# EAGLE design metiumacs4 (EAGLE 7.3.0)
metium
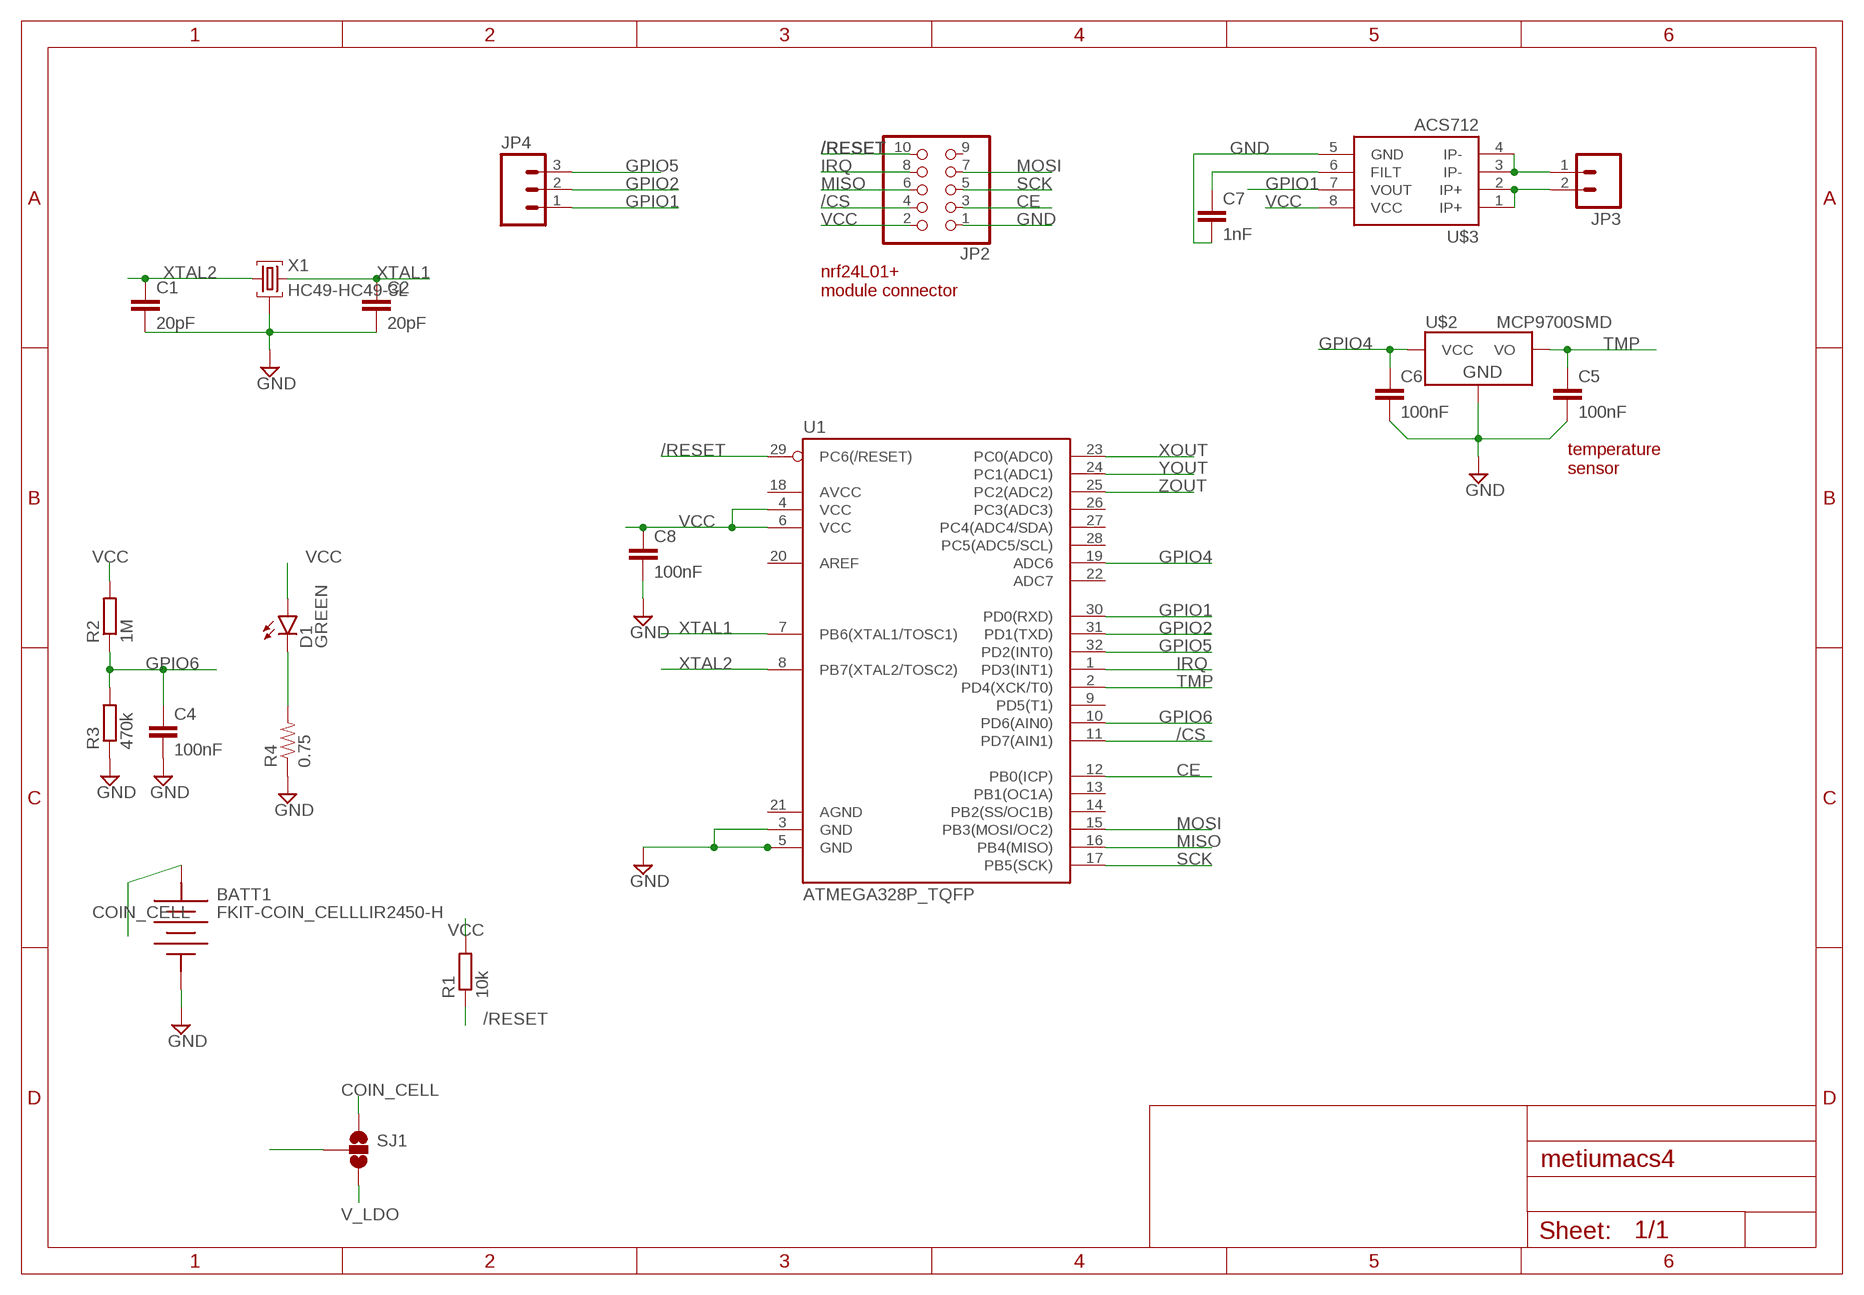
[diagram p0: schematic, sheet 1]

## Parts
BATT1  FKIT-COIN_CELLLIR2450-H  [FKIT-LIR2450-H]
C1  20pF  CAP0805  [0805]
C2  20pF  CAP0805  [0805]
C4  100nF  C-EUC0805  [C0805]
C5  100nF  C-EUC0805  [C0805]
C6  100nF  C-EUC0805  [C0805]
C7  1nF  1NF/1000PF-50V-10%(0603)  [0603-CAP]
C8  100nF  CAP0805  [0805]
D1  GREEN  LED-GREEN0603  [LED-0603]
JP2  PINHD-2X5  [2X05M]
JP3  M02PTH4  [1X02_XTRA_BIG]
JP4  M03LONGPADS  [1X03_LONGPADS]
R1  10k  R-EU_R0805  [R0805]
R2  1M  R-EU_R0805  [R0805]
R3  470k  R-EU_R0805  [R0805]
R4  0.75  0.75OHM-1/4W-1%(0805)  [0805]
SJ1  SOLDERJUMPER_2WAYS  [SJ_3]
U1  ATMEGA328P_TQFP  [TQFP32-08]
U$2  MCP9700SMD  [SOT23-3]
U$3  ACS712  [SO08]
X1  HC49-HC49-3L  [HC49-3L]

## Nets
/CS: JP2.4 U1.11(PD7(AIN1))
/RESET: JP2.10 R1.1 U1.29(PC6(/RESET))
CE: JP2.3 U1.12(PB0(ICP))
COIN_CELL: BATT1.POS SJ1.1
FS1: JP3.1 U$3.3(IP-) U$3.4(IP-)
FS2: JP3.2 U$3.1(IP+) U$3.2(IP+)
GND: BATT1.NEG C1.2 C2.2 C4.2 C5.2 C6.2 C7.2 C8.2 JP2.1 R3.1 R4.1 U1.3(GND) U1.5(GND) U$2.3(GND) U$3.5(GND) X1.2
GPIO1: JP4.1 U1.30(PD0(RXD)) U$3.7(VOUT)
GPIO2: JP4.2 U1.31(PD1(TXD))
GPIO4: C6.1 U1.19(ADC6) U$2.1(VCC)
GPIO5: JP4.3 U1.32(PD2(INT0))
GPIO6: C4.1 R2.1 R3.2 U1.10(PD6(AIN0))
IRQ: JP2.8 U1.1(PD3(INT1))
MISO: JP2.6 U1.16(PB4(MISO))
MOSI: JP2.7 U1.15(PB3(MOSI/OC2))
N$2: C7.1 U$3.6(FILT)
N$8: D1.C R4.2
SCK: JP2.5 U1.17(PB5(SCK))
TMP: C5.1 U1.2(PD4(XCK/T0)) U$2.2(VO)
V_LDO: SJ1.3
VCC: C8.1 D1.A JP2.2 R1.2 R2.2 SJ1.2 U1.4(VCC) U1.6(VCC) U$3.8(VCC)
XOUT: U1.23(PC0(ADC0))
XTAL1: C2.1 U1.7(PB6(XTAL1/TOSC1)) X1.3
XTAL2: C1.1 U1.8(PB7(XTAL2/TOSC2)) X1.1
YOUT: U1.24(PC1(ADC1))
ZOUT: U1.25(PC2(ADC2))
Unconnected: JP2.9 U1.9(PD5(T1)) U1.13(PB1(OC1A)) U1.14(PB2(SS/OC1B)) U1.18(AVCC) U1.20(AREF) U1.21(AGND) U1.22(ADC7) U1.26(PC3(ADC3)) U1.27(PC4(ADC4/SDA)) U1.28(PC5(ADC5/SCL))

## Notes on the sheet
- nrf24L01+ 
  module connector
- temperature
  sensor

## Library data of the parts
BATT1 = SparkFun-Electromechanical:FKIT-COIN_CELL: Fabrick.it Coin Cell Holder Coin cell holder for 24.5mm rechargable coin cell
C1 C2 C8 = SparkFun-Passives:CAP: Capacitor Standard 0603 ceramic capacitor, and 0.1" leaded capacitor.
C4-C6 = rcl:C-EU: CAPACITOR, European symbol
C7 = SparkFun-Capacitors:1NF/1000PF-50V-10%(0603): CAP-07886; PROD_ID: CAP-07886
D1 = SparkFun-LED:LED-GREEN: Various green LEDs Green LEDs used in SFE Production 0603- DIO-00821 LARGE- DIO-00862 LILYPAD- DIO-09910; PROD_ID: DIO-00821
JP2 = madar:PINHD-2X5: PIN HEADER
JP3 = SparkFun-Connectors:M02: Standard 2-pin 0.1" header. Use with - straight break away headers ( PRT-00116) - right angle break away headers (PRT-00553) - swiss pins (PRT-00743) - machine pins (PRT-00117) - female headers (PRT-00115) Molex polarized connector foot print use with: PRT-08233 with associated crimp pins and housings. 2.54_SCREWTERM for use with PRT-10571. 3.5mm Screw Terminal footprints for PRT-08084 5mm Screw Terminal footprints for use with PRT-08432
JP4 = SparkFun-Connectors:M03: Header 3 Standard 3-pin 0.1" header. Use with straight break away headers (SKU : PRT-00116), right angle break away headers (PRT-00553), swiss pins (PRT-00743), machine pins (PRT-00117), and female headers (PRT-00115). Molex polarized connector foot print use with SKU : PRT-08232 with associated crimp pins and housings.
R1-R3 = rcl:R-EU_: RESISTOR, European symbol
R4 = SparkFun-Resistors:0.75OHM-1/4W-1%(0805): RES-08474; PROD_ID: RES-08474
SJ1 = SparkFun-Passives:SOLDERJUMPER_2WAY: Solder Jumper 2 way solder jumper
U1 = SparkFun-DigitalIC:ATMEGA328P_TQFP; PROD_ID: IC-09069
U$2 = SparkFun-Sensors:MCP9700: Analog-output temperature sensor
U$3 = SparkFun-AnalogIC:ACS712: Hall-effect-based isolated linear current sensor
X1 = IQD-Frequency-Products:HC49: Crystals; MFD: IQD Frequency Products

## Board
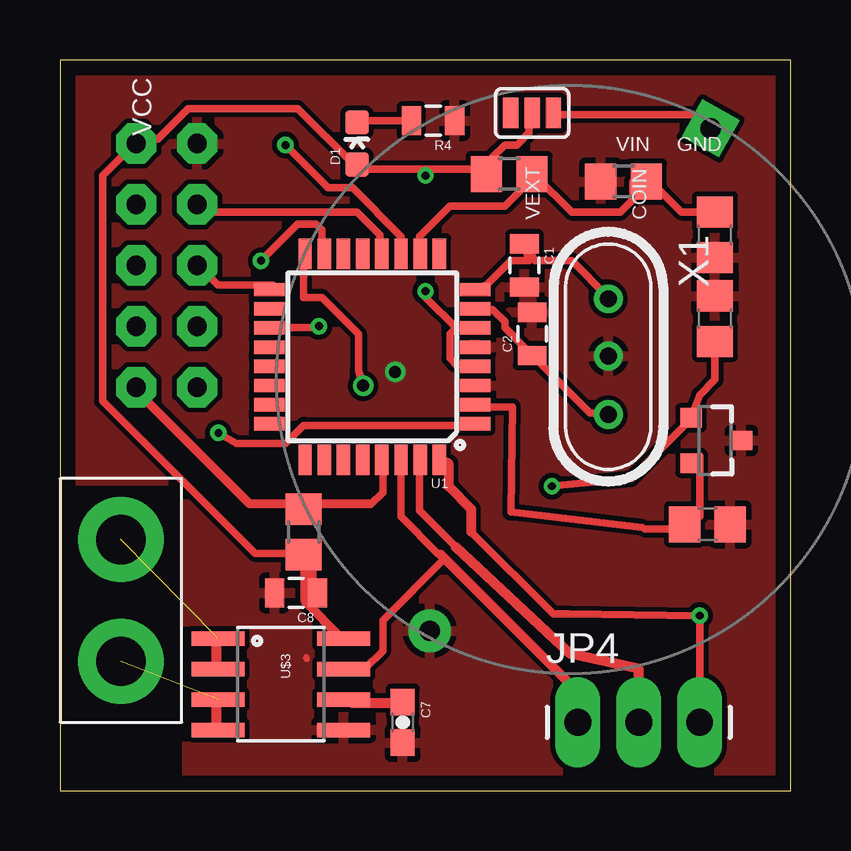
[diagram p1: board, top side]
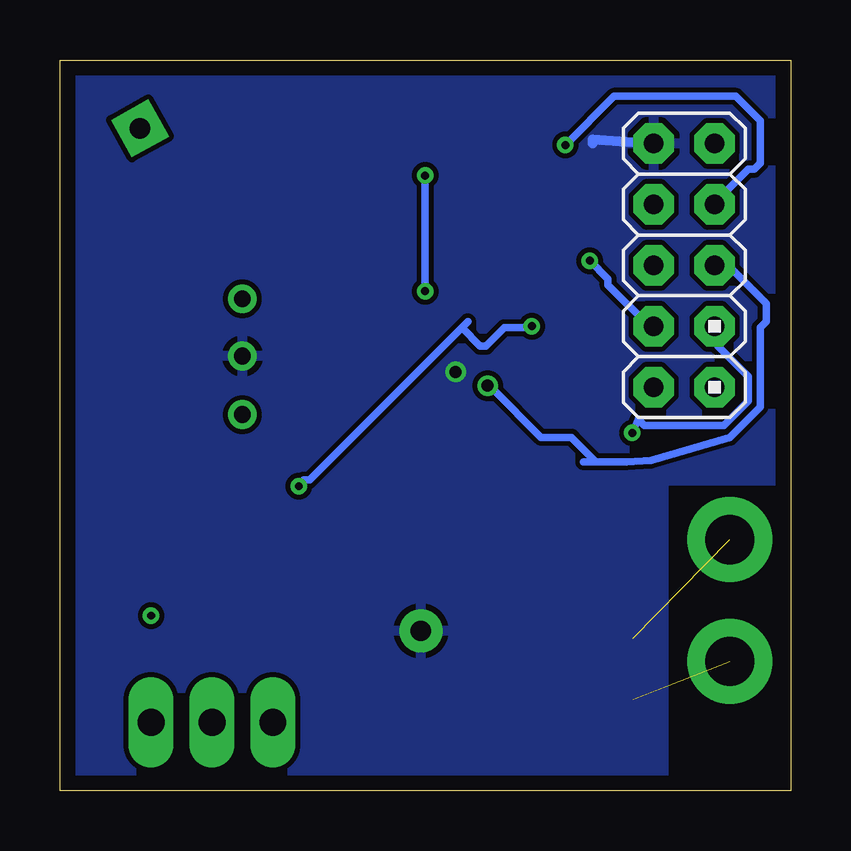
[diagram p2: board, bottom side, seen from below]

Size 30.47 x 30.47 mm. Coordinates in mm from the lower left corner, seen from the top.
Outline: 0,0 30.47,0 30.47,30.47 0,30.47 0,0
Copper layers (1*16): Top 0.0356mm / dielectric 1.5011mm / Bottom 0.0356mm
Design rules "LaenPCBOrder *": minimum track width 12mil, minimum drill 13mil, track to track 8mil, track to pad 10mil, pad to pad 8mil, via to via 15mil, smd to smd 6mil, copper to edge 25mil, drill to drill 15mil, minimum pad ring 7mil, minimum via ring 7mil, stop-mask expansion 4mil, vias tented up to drill 0mil, thermal gap 10mil
tRestrict: area 0.6,0.2 to 5.1,12.7
bRestrict: area 0.6,0.2 to 5.1,12.7

### Footprints (pad centres in the part's own frame; a part is rotated, then mirrored left to right if it is on the bottom)
FKIT-LIR2450-H = drill 0.85 pad 1.778: NEG -12,0 | drill 0.85 pad 1.778 square: POS 12,0
0805 = smd 0.8 x 1.2: 1 -0.9,0; 2 0.9,0
C0805 = smd 1.3 x 1.5: 1 -0.95,0; 2 0.95,0
0603-CAP = smd 1.1 x 1: 1 -0.85,0; 2 0.85,0
LED-0603 = smd 1 x 1: A 0,-0.877; C 0,0.877
2X05M = drill 0.8 pad 1.676 octagon: 1 -5.08,-1.27; 2 -5.08,1.27; 3 -2.54,-1.27; 4 -2.54,1.27; 5 0,-1.27; 6 0,1.27; 7 2.54,-1.27; 8 2.54,1.27; 9 5.08,-1.27; 10 5.08,1.27
1X02_XTRA_BIG = drill 2.057 pad 3.556: 1 -2.54,0; 2 2.54,0
1X03_LONGPADS = drill 1.118 pad 1.88 long: 1 0,0; 2 2.54,0; 3 5.08,0
R0805 = smd 1.3 x 1.5: 1 -0.95,0; 2 0.95,0
SJ_3 = smd 0.635 x 1.27: 1 -0.889,0; 2 0,0; 3 0.889,0
TQFP32-08 = smd 1.27 x 0.559: 1 -4.293,2.8; 2 -4.293,2; 3 -4.293,1.2; 4 -4.293,0.4; 5 -4.293,-0.4; 6 -4.293,-1.2; 7 -4.293,-2; 8 -4.293,-2.8; 17 4.293,-2.8; 18 4.293,-2; 19 4.293,-1.2; 20 4.293,-0.4; 21 4.293,0.4; 22 4.293,1.2; 23 4.293,2; 24 4.293,2.8 | smd 0.559 x 1.27: 9 -2.8,-4.293; 10 -2,-4.293; 11 -1.2,-4.293; 12 -0.4,-4.293; 13 0.4,-4.293; 14 1.2,-4.293; 15 2,-4.293; 16 2.8,-4.293; 25 2.8,4.293; 26 2,4.293; 27 1.2,4.293; 28 0.4,4.293; 29 -0.4,4.293; 30 -1.2,4.293; 31 -2,4.293; 32 -2.8,4.293
SOT23-3 = smd 0.8 x 0.9: 1 -0.95,-1; 2 0.95,-1; 3 0,1.1
SO08 = smd 0.61 x 2.21: 1 -1.905,-2.616; 2 -0.635,-2.616; 3 0.635,-2.616; 4 1.905,-2.616; 5 1.905,2.616; 6 0.635,2.616; 7 -0.635,2.616; 8 -1.905,2.616
HC49-3L = drill 0.7 pad 1.2: 1 -2.413,0; 2 -0.027,0; 3 2.413,0

### Placement (x,y rotation side)
BATT1  21.27,17.14 60.8 top
C1  19.37,21.91 270 top
C2  19.68,19.05 90 top
C4  27.3,23.18 270 top
C5  26.99,11.11 0 top
C6  27.3,19.68 90 top
C7  14.29,2.86 270 top
C8  9.84,8.26 180 top
D1  12.38,26.99 0 top
JP2  4.45,21.91 270 bottom
JP3  2.54,7.94 90 top
JP4  21.59,2.86 0 top
R1  10.16,10.79 270 top
R2  18.73,25.72 180 top
R3  23.5,25.4 0 top
R4  15.56,27.94 180 top
SJ1  19.68,28.26 180 top
U1  13.02,18.1 180 top
U$2  27.3,14.61 270 top
U$3  9.21,4.45 270 top
X1  22.86,18.1 270 top

### Tracks (layer width: path | path; a pad name or v marks a point on that pad's centre or on a via)
/CS  (via drill 0.33)
  Top 0.305: v9.4,26.92 11.18,25.15 12.19,25.15 14.22,23.11 14.22,22.61 U1.11
  Bottom 0.305: v9.4,26.92 7.37,28.96 2.29,28.96 1.27,27.94 1.27,26.16 1.52,25.91 1.78,25.91 3.05,24.64 JP2.4
/RESET
  Top 0.305: U1.29 13.46,13.72 13.46,12.45 12.95,11.94 12.85,11.98
  Top 0.381: 12.85,11.98 10.22,11.98 R1.1 9.93,11.98 7.89,11.98 3.21,16.65 JP2.10
CE
  Top 0.305: JP2.3 5.71,24.13 12.38,24.13 13.34,23.18 13.34,22.54 U1.12
COIN_CELL
  Top 0.305: SJ1.1 20.57,28.19 26.42,28.19 26.92,27.69 BATT1.POS
FS1  (1 unrouted)
  Top 0.406: U$3.4 6.5,2.44 6.5,3.66 U$3.3
FS2  (1 unrouted)
  Top 0.406: U$3.2 6.5,5.28 6.5,6.1 U$3.1
GND  (via drill 0.5)
  Top 0.254: 10.29,5.49 10.26,5.57
  Bottom 0.406: JP2.1 8.27,27.16 8.27,26.99
  other vias: 13.97,17.46
  pour Top: -0.32,-0.32 30.8,-0.32 30.8,30.8 -0.32,30.8
  pour Bottom: 0,0 30.48,0 30.48,30.48 0,30.48
GPIO1
  Top 0.305: 16.03,9.68 13.46,7.11 13.46,5.84 12.7,5.08 U$3.7 | U1.30 14.22,13.72 14.22,11.43 15.75,9.91 15.88,9.84
  Top 0.406: 15.88,9.84 16.03,9.68 21.59,4.13 JP4.1
GPIO2
  Top 0.305: 16.51,10.16 14.99,11.68 14.99,13.72 U1.31
  Top 0.406: 16.51,10.16 21.27,5.71 24.13,5.08 JP4.2
GPIO4  (via drill 0.33)
  Top 0.305: C6.1 27.3,17.14 26.67,16.51 U$2.1 26.04,15.24 23.81,13.02 v20.51,12.7 | v10.79,19.37 10.67,19.3 8.89,19.3 U1.19
  Bottom 0.305: 13.72,19.3 20.07,12.95 20.32,12.95 20.57,12.7 v20.51,12.7 | 13.72,19.3 13.46,19.56 | v10.79,19.37 10.92,19.3 11.94,19.3 12.7,18.54 12.95,18.54 13.72,19.3
GPIO5  (via drill 0.33)
  Top 0.305: 17.14,10.79 20.57,7.37 21.21,7.37 v26.67,7.3 JP4.3
  Top 0.406: 17.14,10.79 17.14,11.75 16.19,12.7 16.19,13.65 U1.32
GPIO6
  Top 0.305: 19.81,25.65 18.54,24.38 16.26,24.38 14.99,23.11 14.99,22.61 U1.10 | 19.81,25.65 21.34,24.13 23.37,24.13 23.88,24.64 23.88,25.4 R3.2 24.64,25.4 25.91,24.13 27.18,24.13 C4.1 | 19.81,25.65 R2.1
IRQ  (via drill 0.33)
  Top 0.305: v6.6,14.92 7.37,14.48 9.4,14.48 10.16,15.24 17.27,15.24 U1.1
  Bottom 0.305: JP2.8 3.05,19.3 3.05,18.54 1.78,17.27 1.78,16.26 2.79,15.24 6.1,15.24 6.35,15.49 v6.6,14.92
MISO  (via drill 0.5)
  Top 0.305: U1.16 10.16,22.35 10.16,20.57 10.92,20.57 12.45,19.05 12.45,17.53 v12.64,16.89
  Bottom 0.305: JP2.6 3.05,21.84 2.54,21.84 1.02,20.32 1.02,19.56 1.27,19.3 1.27,16 2.54,14.73 5.84,13.78 6.86,13.72 8.13,13.72 | 8.13,13.72 8.64,13.72 | 8.13,13.72 9.14,14.73 10.41,14.73 12.45,16.76 v12.64,16.89
MOSI  (via drill 0.33)
  Top 0.305: v8.38,22.1 9.91,23.62 10.67,23.62 10.92,23.37 10.92,22.61 U1.15
  Bottom 0.305: v8.38,22.1 7.62,21.34 7.62,21.08 5.84,19.3 JP2.7
N$2
  Top 0.406: C7.1 14.22,3.66 12.19,3.66 U$3.6
N$8
  Top 0.305: R4.2 12.45,27.94 D1.C
SCK
  Top 0.305: U1.17 8.89,21.08 6.6,21.08 5.84,21.84 JP2.5
TMP
  Top 0.305: U$2.2 26.67,13.97 26.67,11.43 C5.1 25.91,10.92 24.38,10.92 24.26,10.99 18.8,11.62 18.86,16 17.53,16 U1.2
VCC  (via drill 0.33)
  Top 0.254: 10.16,9.65 R1.2 | 10.67,8.38 C8.1 10.92,8.13 | 11.68,6.35 U$3.8
  Top 0.305: 15.24,25.91 17.78,25.91 R2.2 18.03,26.42 18.54,26.92 19.05,26.92 19.56,27.43 19.56,28.19 SJ1.2 | 15.24,25.91 12.45,25.91 D1.A 12.19,26.16 9.91,28.45 5.33,28.45 4.06,27.18 3.3,27.18 JP2.2 3.05,26.92 1.78,25.65 1.78,16.26 8.13,9.91 10.16,9.91 R1.2 | 15.24,25.91 v15.24,25.65 | 16.51,19.3 16.26,19.05 16.26,18.03 16.51,17.78 17.27,17.78 U1.4 | 16.51,19.3 17.27,19.3 U1.6 | 16.51,19.3 15.24,20.57 v15.24,20.83
  Top 0.381: 10.22,9.64 10.52,9.35 10.52,8.47 C8.1 | 10.22,9.64 10.22,7.89 11.68,6.43 U$3.8 | 10.22,9.64 R1.2
  Bottom 0.305: v15.24,25.65 v15.24,20.83
XTAL1
  Top 0.305: U1.7 17.53,20.07 18.03,20.07 18.54,19.56 18.54,19.3 19.56,18.29 C2.1 19.81,18.03 22.1,15.75 22.86,15.75 X1.3
XTAL2
  Top 0.305: U1.8 17.78,21.08 18.8,22.1 19.56,22.1 C1.1 19.81,22.1 21.34,22.1 22.86,20.57 X1.1

### Text on the board
tNames: VCC | VIN | GND | VEXT | COIN